# Altium project diantiao.PrjPcb
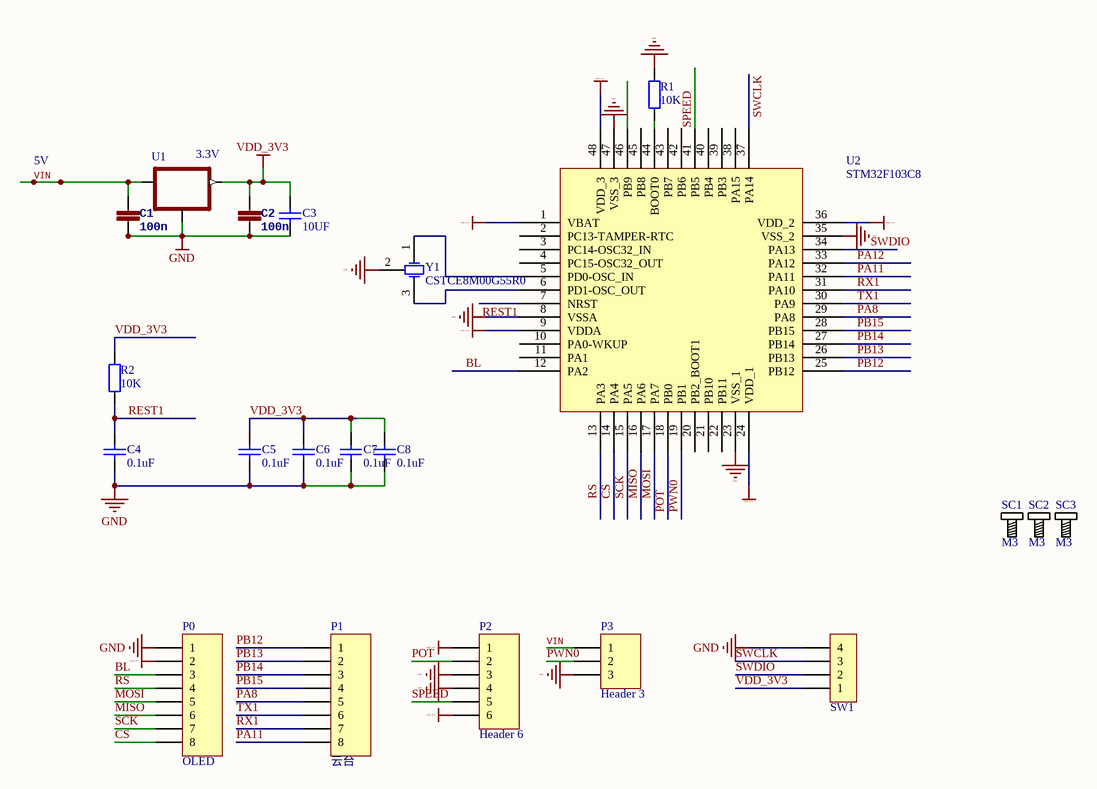
[diagram p0: liuyang.SchDoc]
1 sheet, 21 parts. Net scope: global (net labels, ports and power ports of the same name join across sheets).

## Sheet liuyang.SchDoc
size A4

### Parts
C1  100n  [C0603]
C2  100n  [C0603]
C3  10UF  [C0603]
C4  0.1uF  [C0603]
C5  value 0.1uF  [C0603]  (hidden comment: 10UF)
C6  0.1uF  [C0603]
C7  0.1uF  [C0603]
C8  0.1uF  [C0603]
P0  OLED  [DF13-1.25-8A]
P1  云台  [DF13-1.25-8A]
P2  Header 6  [DF13-1.25-6A]
P3  Header 3  [DF13-1.25-3A]
R1  10K  [R0603]
R2  10K  [R0603]
SC1  M3  [SCRREW_M3]
SC2  M3  [SCRREW_M3]
SC3  M3  [SCRREW_M3]
SW1  CON4  [DF13-1.25-4A]  (value not drawn)
U1  3.3V  [SOT23]
U2  STM32F103C8  [ST_LQFP48]
Y1  CSTCE8M00G55R0  [CRYSMD3.2X1.3]

### Nets
GND: C1.2 C2.2 C3.1 C4.1 C5.1 C6.1 C7.1 C8.1 P0.1 P2.3 P2.4 P3.3 R1.1 SW1.4 U1.1(GND) U2.8(VSSA) U2.23(VSS_1) U2.35(VSS_2) U2.47(VSS_3) Y1.2(GND)
VDD_3V3: C2.1 C3.2 C5.2 C6.2 C7.2 C8.2 P0.2 P2.1 P2.6 R2.2 SW1.1 U1.2(OUT) U2.1(VBAT) U2.9(VDDA) U2.24(VDD_1) U2.36(VDD_2) U2.48(VDD_3)
BL: P0.3 U2.12(PA2)
CS: P0.8 U2.14(PA4)
MISO: P0.6 U2.16(PA6)
MOSI: P0.5 U2.17(PA7)
PA8: P1.5 U2.29(PA8)
PA11: P1.8 U2.32(PA11)
PA12: U2.33(PA12)
PB12: P1.1 U2.25(PB12)
PB13: P1.2 U2.26(PB13)
PB14: P1.3 U2.27(PB14)
PB15: P1.4 U2.28(PB15)
POT: P2.2 U2.18(PB0)
PWN0: P3.2 U2.19(PB1)
REST1: C4.2 R2.1 U2.7(NRST)
RS: P0.4 U2.13(PA3)
RX1: P1.7 U2.31(PA10)
SCK: P0.7 U2.15(PA5)
SPEED: P2.5 U2.41(PB5)
SWCLK: SW1.3 U2.37(PA14)
SWDIO: SW1.2 U2.34(PA13)
TX1: P1.6 U2.30(PA9)
VIN: C1.1 P3.1 U1.3(IN)
NetR1_2: R1.2 U2.44(BOOT0)
NetU2_5: U2.5(PD0-OSC_IN) Y1.1(OSC1)
NetU2_6: U2.6(PD1-OSC_OUT) Y1.3(OSC2)

Not connected (* = marked no-connect by the designer): U2 2(PC13-TAMPER-RTC) 3(PC14-OSC32_IN) 4(PC15-OSC32_OUT) 10(PA0-WKUP) 11(PA1) 20(PB2_BOOT1) 21(PB10) 22(PB11) 38(PA15) 39(PB3) 40(PB4) 42(PB6) 43(PB7) 45(PB8) 46(PB9)

### Notes on the sheet
- 5V

### Library data of the parts
C1 C2 = C-EUC0603: CAPACITOR, European symbol
C3-C8 = Cap: Capacitor; Published: 8-Jun-2000; LatestRevisionDate: 17-Jul-2002; LatestRevisionNote: Re-released for DXP Platform.; PackageReference: RAD-0.3; Publisher: Altium Limited
  C3: Value: 10UF
  C4 C6-C8: Value: 0.1uF
P0 P1 = Header 8: Header, 8-Pin; LatestRevisionDate: 17-Jul-2002; LatestRevisionNote: Re-released for DXP Platform.; Publisher: Altium Limited
P2 = Header 6: Header, 6-Pin; LatestRevisionDate: 17-Jul-2002; LatestRevisionNote: Re-released for DXP Platform.; Publisher: Altium Limited
P3 = Header 3: Header, 3-Pin; LatestRevisionDate: 17-Jul-2002; LatestRevisionNote: Re-released for DXP Platform.; Publisher: Altium Limited
R1 R2 = Res2: Resistor; Published: 8-Jun-2000; LatestRevisionDate: 17-Jul-2002; LatestRevisionNote: Re-released for DXP Platform.; PackageReference: AXIAL-0.4; Publisher: Altium Limited; Value: 10K
SC1-SC3 = Screw_M3: Screw
U1 = XC6206
Y1 = XTAL-3